# EAGLE design voltagetransfer (EAGLE 6.4)
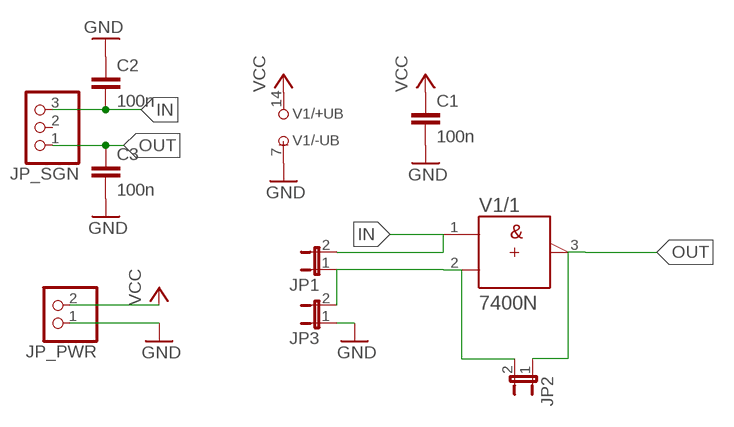
[diagram p0: schematic, sheet 1]

## Parts
C1  100n  C-EU025-024X044  [C025-024X044]
C2  100n  C-EU025-024X044  [C025-024X044]
C3  100n  C-EU025-024X044  [C025-024X044]
JP1  JP1E  [JP1]
JP2  JP1E  [JP1]
JP3  JP1E  [JP1]
JP_PWR  PINHD-1X2/90  [1X02/90]
JP_SGN  PINHD-1X3/90  [1X03/90]
V1  7400N  [DIL14]

## Nets
GND: C1.2 C2.1 C3.2 JP3.1 JP_PWR.1 V1.7(/-UB:-UB)
IN: C2.2 JP1.2 JP_SGN.3 V1.1(/1:A)
N$5: JP1.1 JP2.2 JP3.2 V1.2(/1:B)
OUT: C3.1 JP2.1 JP_SGN.1 V1.3(/1:Y)
VCC: C1.1 JP_PWR.2 V1.14(/+UB:+UB)
Unconnected: JP_SGN.2 V1.4(/2:A) V1.5(/2:B) V1.6(/2:Y) V1.8(/3:Y) V1.9(/3:A) V1.10(/3:B) V1.11(/4:Y) V1.12(/4:A) V1.13(/4:B)

## Library data of the parts
C1-C3 = rcl:C-EU: CAPACITOR, European symbol
JP1-JP3 = jumper:JP1E: JUMPER
JP_PWR = pinhead:PINHD-1X2: PIN HEADER
JP_SGN = pinhead:PINHD-1X3: PIN HEADER
V1 = 74ttl-din:74*00: Quad 2-input NAND gate

## Board
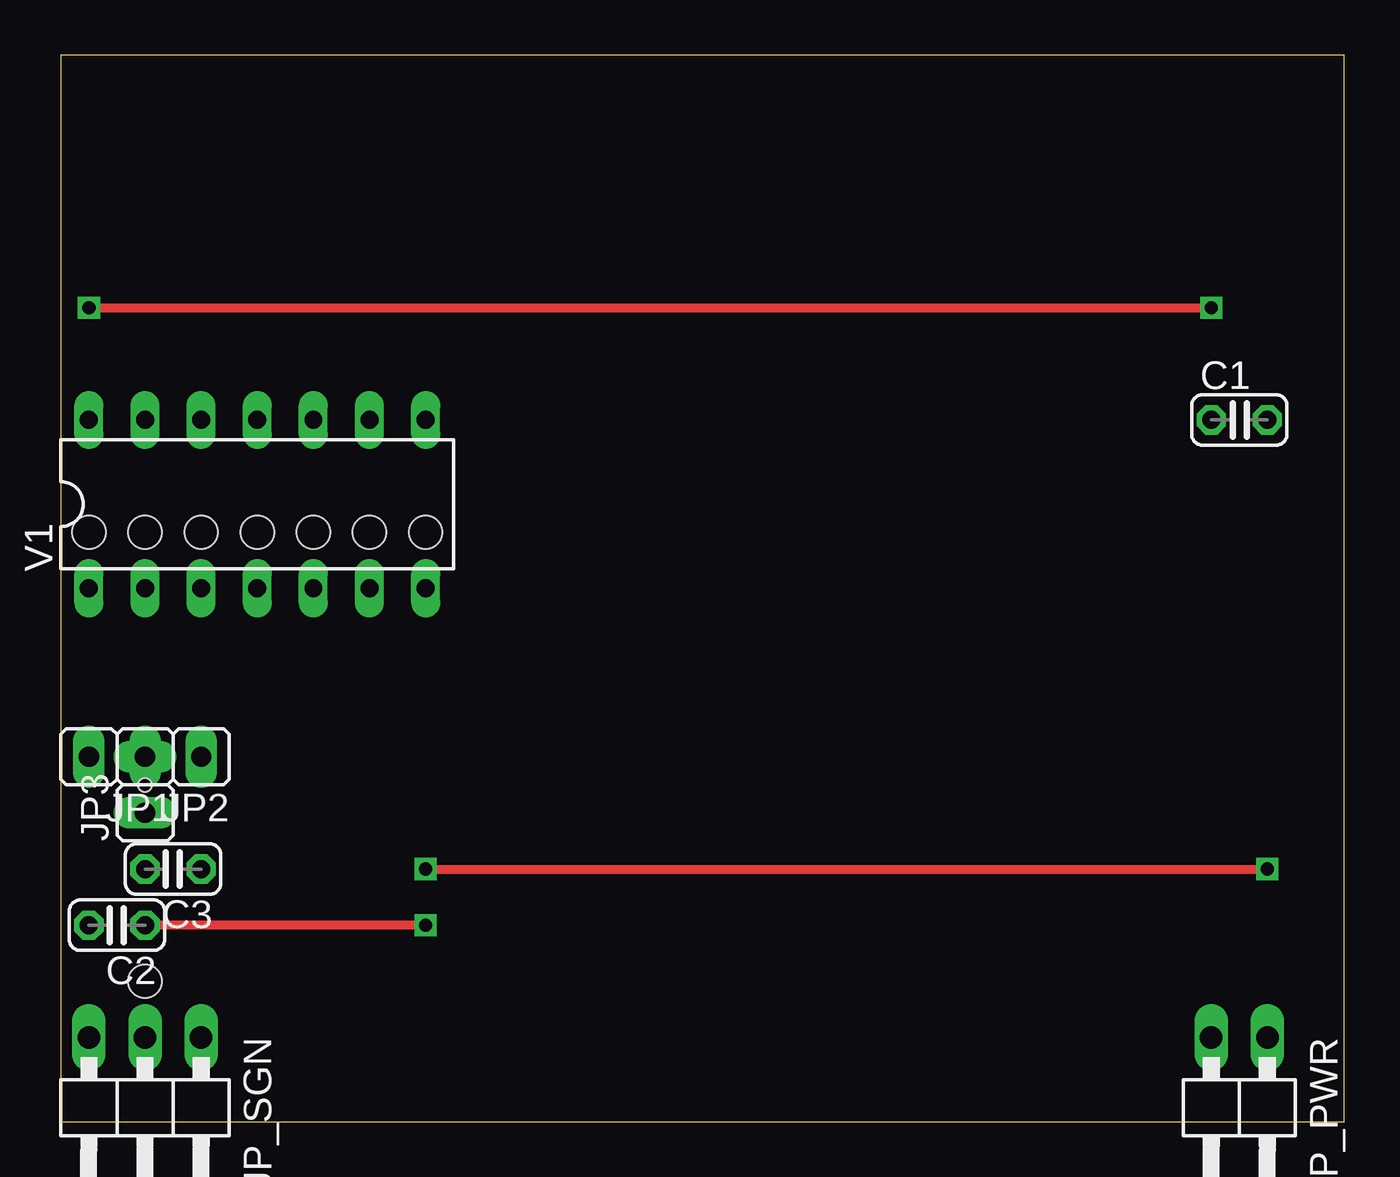
[diagram p1: board, top side]
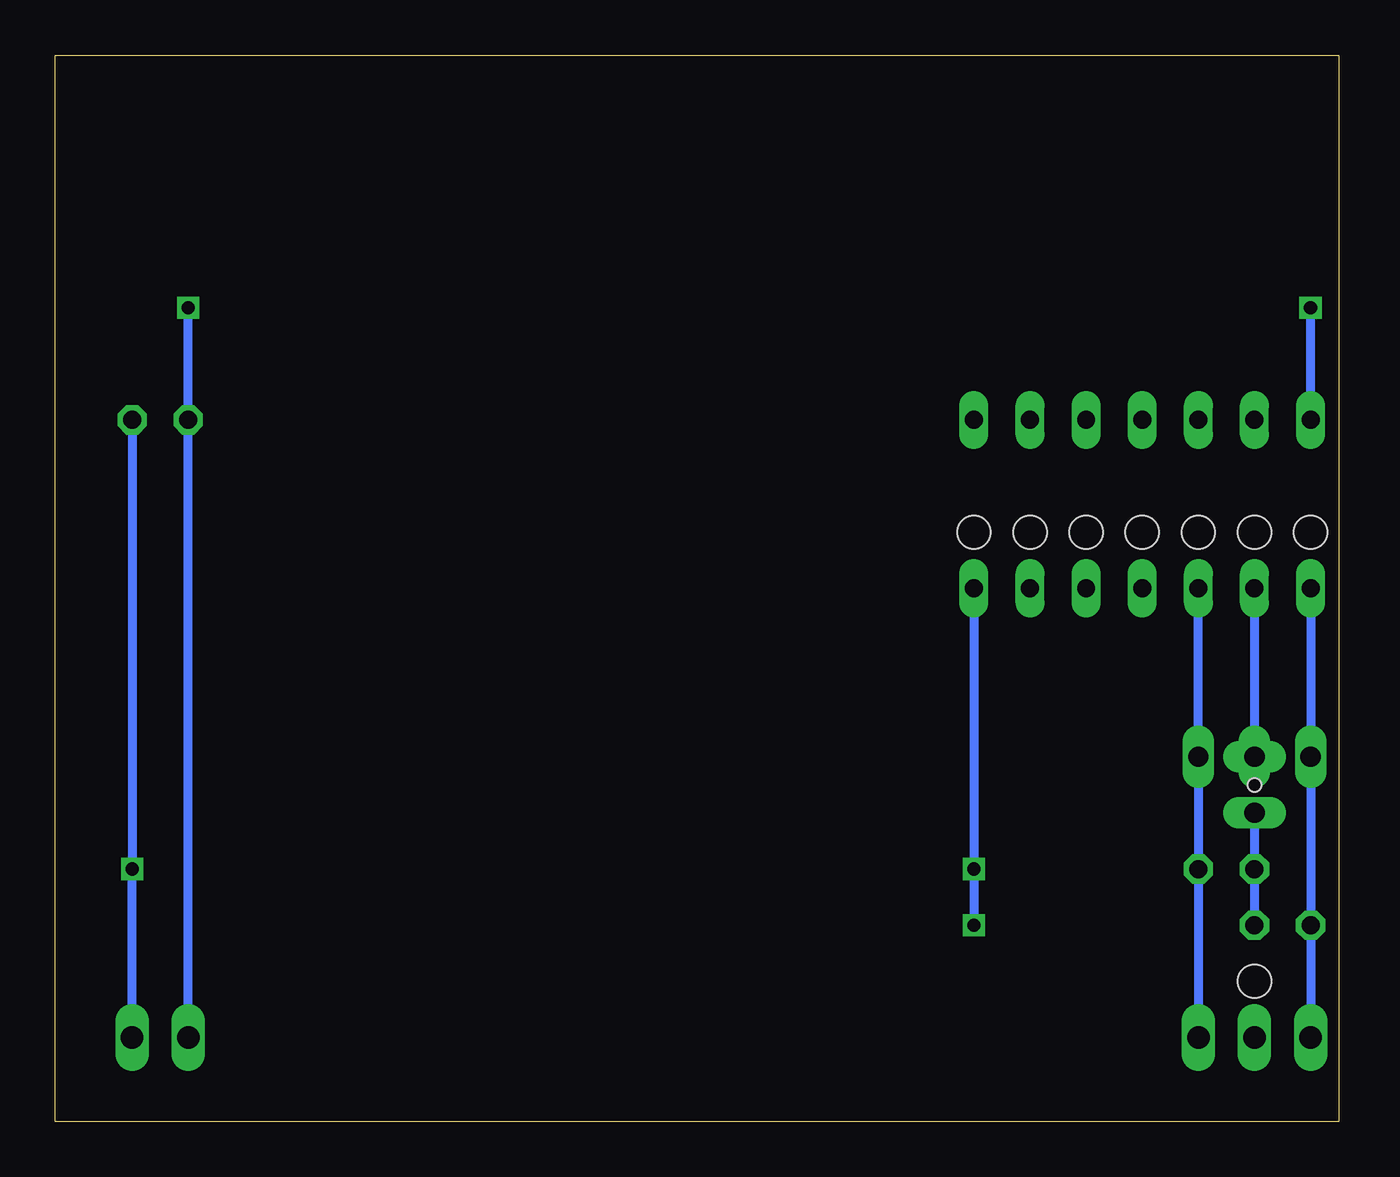
[diagram p2: board, bottom side, seen from below]

Size 58.09 x 48.25 mm. Coordinates in mm from the lower left corner, seen from the top.
Outline: 0,0 58.09,0 58.09,48.25 0,48.25 0,0
Copper layers (1*16): Top 0.035mm / dielectric 1.5mm / Bottom 0.035mm
Design rules "default": minimum track width 10mil, minimum drill 24mil, track to track 8mil, track to pad 8mil, pad to pad 8mil, via to via 8mil, smd to smd 8mil, copper to edge 40mil, drill to drill 8mil, minimum pad ring 10mil, minimum via ring 8mil, stop-mask expansion 4mil, vias tented up to drill 0mil, thermal gap 10mil
Holes 1.5 mm at 1.27,26.67 3.81,26.67 6.35,26.67 8.89,26.67 11.43,26.67 13.97,26.67 16.51,26.67 3.81,6.35
Holes 0.6 mm at 3.81,15.24

### Footprints (pad centres in the part's own frame; a part is rotated, then mirrored left to right if it is on the bottom)
C025-024X044 = drill 0.813 octagon: 1 -1.27,0; 2 1.27,0
JP1 = drill 0.914 long: 1 0,-1.27; 2 0,1.27
1X02/90 = drill 1.016 long: 1 -1.27,-3.81; 2 1.27,-3.81
1X03/90 = drill 1.016 long: 1 -2.54,-3.81; 2 0,-3.81; 3 2.54,-3.81
DIL14 = drill 0.813 long: 1 -7.62,-3.81; 2 -5.08,-3.81; 3 -2.54,-3.81; 4 0,-3.81; 5 2.54,-3.81; 6 5.08,-3.81; 7 7.62,-3.81; 8 7.62,3.81; 9 5.08,3.81; 10 2.54,3.81; 11 0,3.81; 12 -2.54,3.81; 13 -5.08,3.81; 14 -7.62,3.81

### Placement (x,y rotation side)
C1  53.34,31.75 0 top
C2  2.54,8.89 180 top
C3  5.08,11.43 180 top
JP1  2.54,16.51 90 top
JP2  5.08,16.51 90 top
JP3  3.81,15.24 0 top
JP_PWR  53.34,0 180 top
JP_SGN  3.81,0 180 top
V1  8.89,27.94 0 top

### Tracks (layer width: path | path; a pad name or v marks a point on that pad's centre or on a via)
GND  (via drill 0.6)
  Top 0.406: v16.51,11.43 v54.61,11.43 | v16.51,8.89 C2.1
  Bottom 0.406: JP_PWR.1 v54.61,11.43 C1.2 | V1.7 v16.51,11.43 v16.51,8.89 | JP3.1 C3.2 C2.1
IN
  Bottom 0.406: V1.1 JP1.2 C2.2 JP_SGN.3
N$5
  Bottom 0.406: V1.2 JP3.2
OUT
  Bottom 0.406: V1.3 JP2.1 C3.1 JP_SGN.1
VCC  (via drill 0.6)
  Top 0.406: v1.27,36.83 v52.07,36.83
  Bottom 0.406: V1.14 v1.27,36.83 | JP_PWR.2 C1.1 v52.07,36.83

### Text on the board
doc_purple: Voltage transfer | o o=o INV / o / o=o o NAND,NOR / o / o o o XOR / | | VCC | GND